# Altium schematic sheet Light_Ctrol.SchDoc
size A4
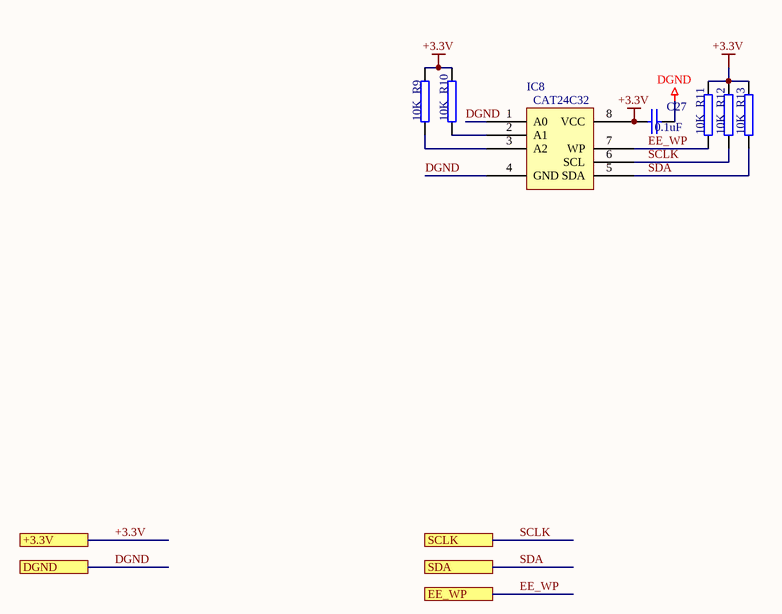
[diagram p0: Light_Ctrol.SchDoc]

## Parts
C27  0.1uF  [0805C]
IC8  CAT24C32  [SO8]
R9  10K  [0805R]
R10  10K  [0805R]
R11  10K  [0805R]
R12  10K  [0805R]
R13  10K  [0805R]

## Ports
+3.3V, DGND, EE_WP, SCLK, SDA

## Nets
+3.3V: C27.2 IC8.8(VCC) R9.1 R10.1 R11.1 R12.1 R13.1 ; port +3.3V
DGND: C27.1 IC8.1(A0) IC8.4(GND) ; port DGND
EE_WP: IC8.7(WP) R11.2 ; port EE_WP
SCLK: IC8.6(SCL) R12.2 ; port SCLK
SDA: IC8.5(SDA) R13.2 ; port SDA
NetIC8_2: IC8.2(A1) R10.2
NetIC8_3: IC8.3(A2) R9.2

## Library data of the parts
C27 = CAP: Capacitor
IC8 = CAT24C32: 品牌： onsemi(安森美)  型号： CAT24C32WI-GT3  接口类型：I2C 存储容量：32Kbit EEPROM 串行 32-Kb I2C CAT24C32 是一款 32-kb I2C 串行 EEPROM 器件，内部组织为 4096 个词，每个词 8 位。它具有 32 字节页写入缓存，支持标准 (100 kHz)、快速 (400 kHz) 和超快 (1 MHz) I2C 协议。外部地址引脚使其能够在同一个总线上放置最多八
R9-R13 = RES2: 品牌： UNI-ROYAL(厚声) 型号： 0805W8F1002T5E 电阻类型：厚膜电阻 阻值：10kΩ 精度：±1% 功率：125mW 温度系数：±100ppm/℃